# Altium project Power delivery test.PrjPcb
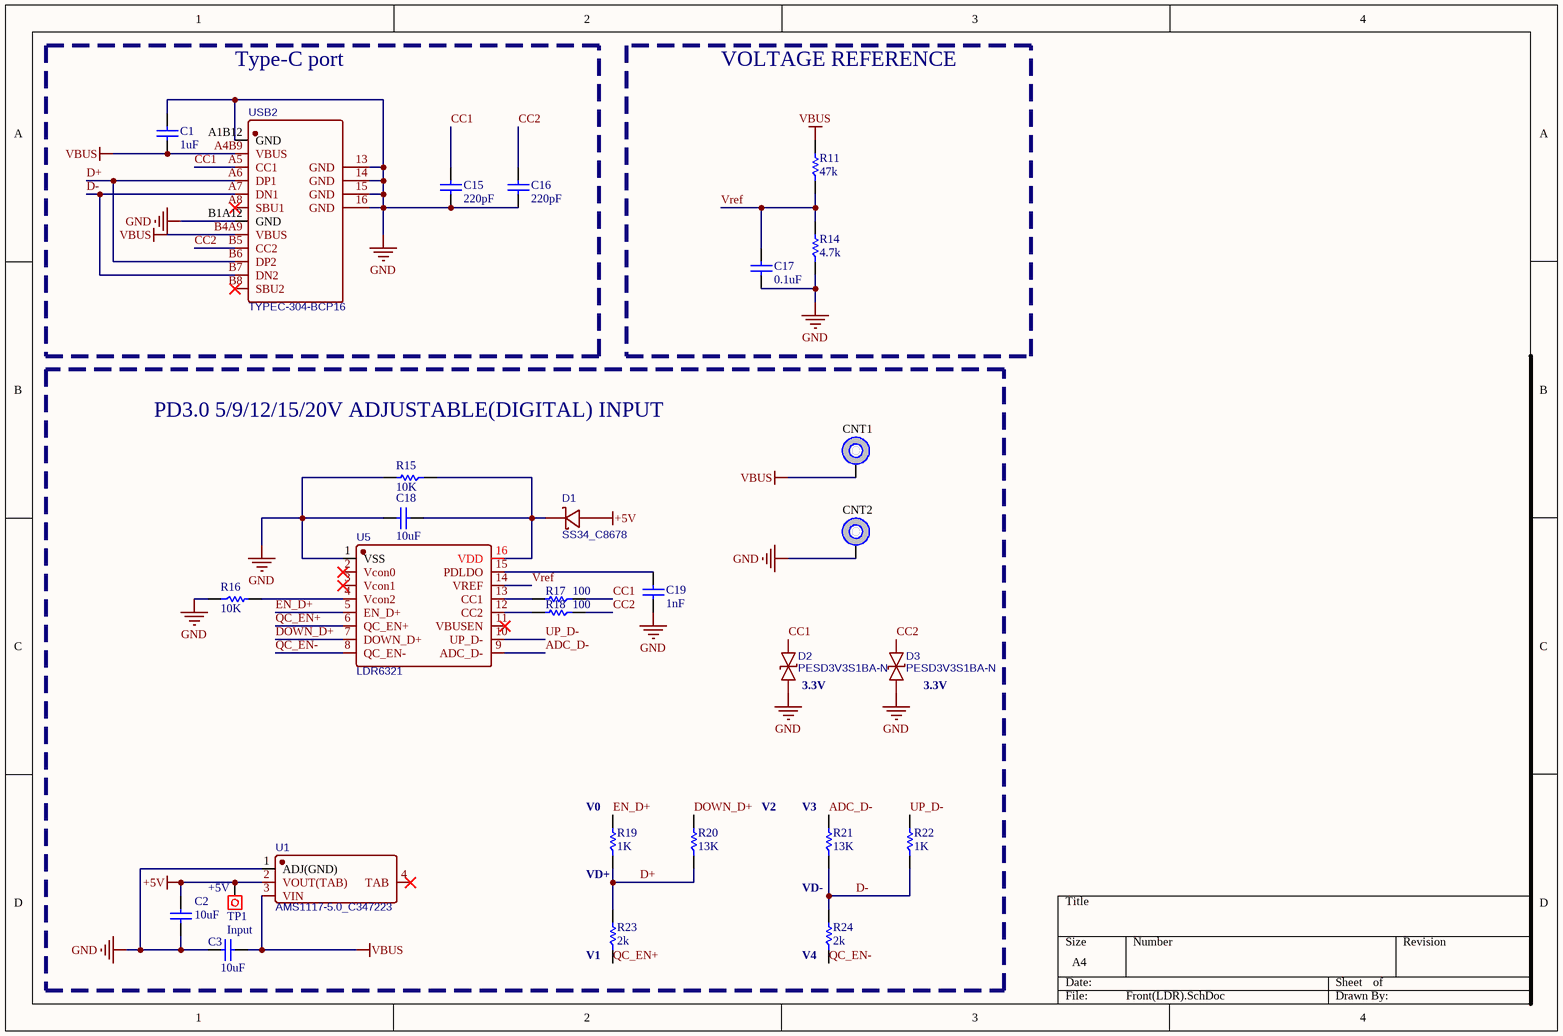
[diagram p0: Front(LDR).SchDoc]
1 sheet, 29 parts. Net scope: global (net labels, ports and power ports of the same name join across sheets).
Board file: PDtest.PcbDoc

## Sheet Front(LDR).SchDoc
size A4; SheetNumber: 1; SheetTotal: 1

### Parts
C1  1uF  [0805C]
C2  10uF  [0805C]
C3  10uF  [0805C]
C15  220pF  [0805C]
C16  220pF  [0805C]
C17  0.1uF  [0805C]
C18  10uF  [0805C]
C19  1nF  [0805C]
CNT1  CST  [M3]  (value not drawn)
CNT2  CST  [M3]  (value not drawn)
D1  SS34_C8678  [DO-214AC_L4.3-W2.7-LS5.3-RD]
D2  PESD3V3S1BA-N  [SOD-523_L1.2-W0.8-LS1.6-BI]
D3  PESD3V3S1BA-N  [SOD-523_L1.2-W0.8-LS1.6-BI]
R11  47k  [0805]
R14  4.7k  [0805]
R15  10K  [0805]
R16  10K  [0805]
R17  100  [0805]
R18  100  [0805]
R19  1K  [0805]
R20  13K  [0805]
R21  13K  [0805]
R22  1K  [0805]
R23  2k  [0805]
R24  2k  [0805]
TP1  INPUT  [Testpoin]
U1  AMS1117-5.0_C347223  [SOT-223_L6.7-W3.5-P2.30-BR]
U5  LDR6321  [SSOP-16_L5.0-W4.4-P0.65-LS6.4-BL]
USB2  TYPEC-304-BCP16  [USB-C-SMD_TYPEC-304-BCP16]

### Blocks framed on the sheet
Type-C port: C1 C15 C16 USB2
VOLTAGE REFERENCE: C17 R11 R14
PD3.0 5/9/12/15/20V ADJUSTABLE(DIGITAL) INPUT: C2 C3 C18 C19 CNT1 CNT2 D1-D3 R15-R24 TP1 U1 U5

### Nets
+5V: C2.1 D1.2(A) TP1.1 U1.2(VOUT(TAB))
GND: C1.1 C2.2 C3.2 C15.2 C16.2 C17.2 C18.1 C19.2 CNT2.1 D2.1 D3.1 R14.1 R15.2 R16.1 U1.1(ADJ(GND)) U5.1(VSS) USB2.13(GND) USB2.14(GND) USB2.15(GND) USB2.16(GND) USB2.A1B12(GND) USB2.B1A12(GND)
VBUS: C1.2 C3.1 CNT1.1 R11.2 U1.3(VIN) USB2.A4B9(VBUS) USB2.B4A9(VBUS)
ADC_D-: R21.2 U5.9(ADC_D-)
CC1: C15.1 D2.2 R17.1 USB2.A5(CC1)
CC2: C16.1 D3.2 R18.1 USB2.B5(CC2)
D+: R19.1 R20.1 R23.2 USB2.A6(DP1) USB2.B6(DP2)
D-: R21.1 R22.1 R24.2 USB2.A7(DN1) USB2.B7(DN2)
DOWN_D+: R20.2 U5.7(DOWN_D+)
EN_D+: R19.2 U5.5(EN_D+)
QC_EN+: R23.1 U5.6(QC_EN+)
QC_EN-: R24.1 U5.8(QC_EN-)
UP_D-: R22.2 U5.10(UP_D-)
Vref: C17.1 R11.1 R14.2 U5.14(VREF)
NetC18_2: C18.2 D1.1(K) R15.1 U5.16(VDD)
NetC19_1: C19.1 U5.15(PDLDO)
NetR16_2: R16.2 U5.4(Vcon2)
NetR17_2: R17.2 U5.13(CC1)
NetR18_2: R18.2 U5.12(CC2)

Not connected (* = marked no-connect by the designer): U1 4(TAB)*; U5 2(Vcon0)* 3(Vcon1)* 11(VBUSEN)*; USB2 A8(SBU1)* B8(SBU2)*

### Notes on the sheet
- (near D2) 3.3V
- (near D3) 3.3V
- (near R19) V0
- V2
- (near R21) V3
- (near TP1) +5V
- (near R19) VD+
- VD-
- (near R23) V1
- (near R24) V4

### Library data of the parts
C1 = C_1uf: Capacitor; Reviewed by: RM - 2018/08/05; Revision: July-2002: Re-released for DXP Platform.; Supplier 1: *; Supplier Part Number 1: *; Value: 1uF
C2 C3 C18 = C_10uf: Capacitor; Reviewed by: RM - 2018/08/05; Revision: July-2002: Re-released for DXP Platform.; Supplier 1: *; Supplier Part Number 1: *; Value: 10uF
C15 C16 = C_220pF: Capacitor; Reviewed by: RM - 2018/08/05; Revision: July-2002: Re-released for DXP Platform.; Supplier 1: *; Supplier Part Number 1: *; Value: 220pF
C17 = C_0.1uf: Capacitor; Reviewed by: RM - 2018/08/05; Revision: July-2002: Re-released for DXP Platform.; Supplier 1: *; Supplier Part Number 1: *; Value: 0.1uF
C19 = C_1nf: Capacitor; Reviewed by: RM - 2018/08/05; Revision: July-2002: Re-released for DXP Platform.; Supplier 1: *; Supplier Part Number 1: *; Value: 1nF
CNT1 CNT2 = SO3040
D1 = SS34_C8678: BOM_Manufacturer Part: SS34; BOM_Manufacturer: MDD; BOM_Supplier: LCSC; BOM_Supplier Part: C8678; BOM_JLCPCB Part Class: Basic Part; spicePre: D; spiceSymbolName: SS34_C8678
D2 D3 = PESD3V3S1BA-N: TVS3V3; BOM_Manufacturer: Bourne Semicon (Shenzhen); Contributor: LCSC; BOM_Supplier: LCSC; BOM_Supplier Part: C316037; BOM_Manufacturer Part: PESD3V3S1BA-N; BOM_JLCPCB Part Class: Extended Part; spicePre: D; spiceSymbolName: PESD3V3S1BA-N
R11 = R_47k: Resistor; Reviewed by: RM - 2018/08/05; Supplier 1: *; Suppler Part Number 1: *; Value: 47k
R14 = R_4.7k: Resistor; Reviewed by: RM - 2018/08/05; Supplier 1: *; Suppler Part Number 1: *; Value: 4.7k
R15 R16 = R_10k: Resistor; Reviewed by: RM - 2018/08/05; Supplier 1: *; Suppler Part Number 1: *; Value: 10K
R17 R18 = R_100: Resistor; Reviewed by: RM - 2018/08/05; Supplier 1: *; Suppler Part Number 1: *; Value: 100
R19 R22 = R_1k: Resistor; Reviewed by: RM - 2018/08/05; Supplier 1: *; Suppler Part Number 1: *; Value: 1K
R20 R21 = R_13k: Resistor; Reviewed by: RM - 2018/08/05; Supplier 1: *; Suppler Part Number 1: *; Value: 13K
R23 R24 = R_2k: Resistor; Reviewed by: RM - 2018/08/05; Supplier 1: *; Suppler Part Number 1: *; Value: 2k
TP1 = Test Point: Pad; Value: Input
U1 = AMS1117-5.0_C347223: BOM_Manufacturer: Youtai Semiconductor Co., Ltd.; Contributor: LCSC; BOM_Supplier: LCSC; BOM_Supplier Part: C347223; BOM_Manufacturer Part: AMS1117-5.0; BOM_JLCPCB Part Class: Extended Part; spicePre: U; spiceSymbolName: AMS1117-5.0_C347223
U5 = LDR6321: BOM_Manufacturer: Legendary(乐得瑞); Contributor: LCSC; BOM_Supplier: LCSC; BOM_Supplier Part: C2919632; BOM_Manufacturer Part: LDR6321; BOM_JLCPCB Part Class: Extended Part; spicePre: U; spiceSymbolName: LDR6321
USB2 = TYPEC-304-BCP16: BOM_Manufacturer: XUNPU; Contributor: LCSC; BOM_Supplier: LCSC; BOM_Supplier Part: C720629; BOM_Manufacturer Part: TYPEC-304-BCP16; BOM_JLCPCB Part Class: Extended Part; spicePre: U; spiceSymbolName: TYPEC-304-BCP16